# EAGLE design switch (EAGLE 7.6.0)
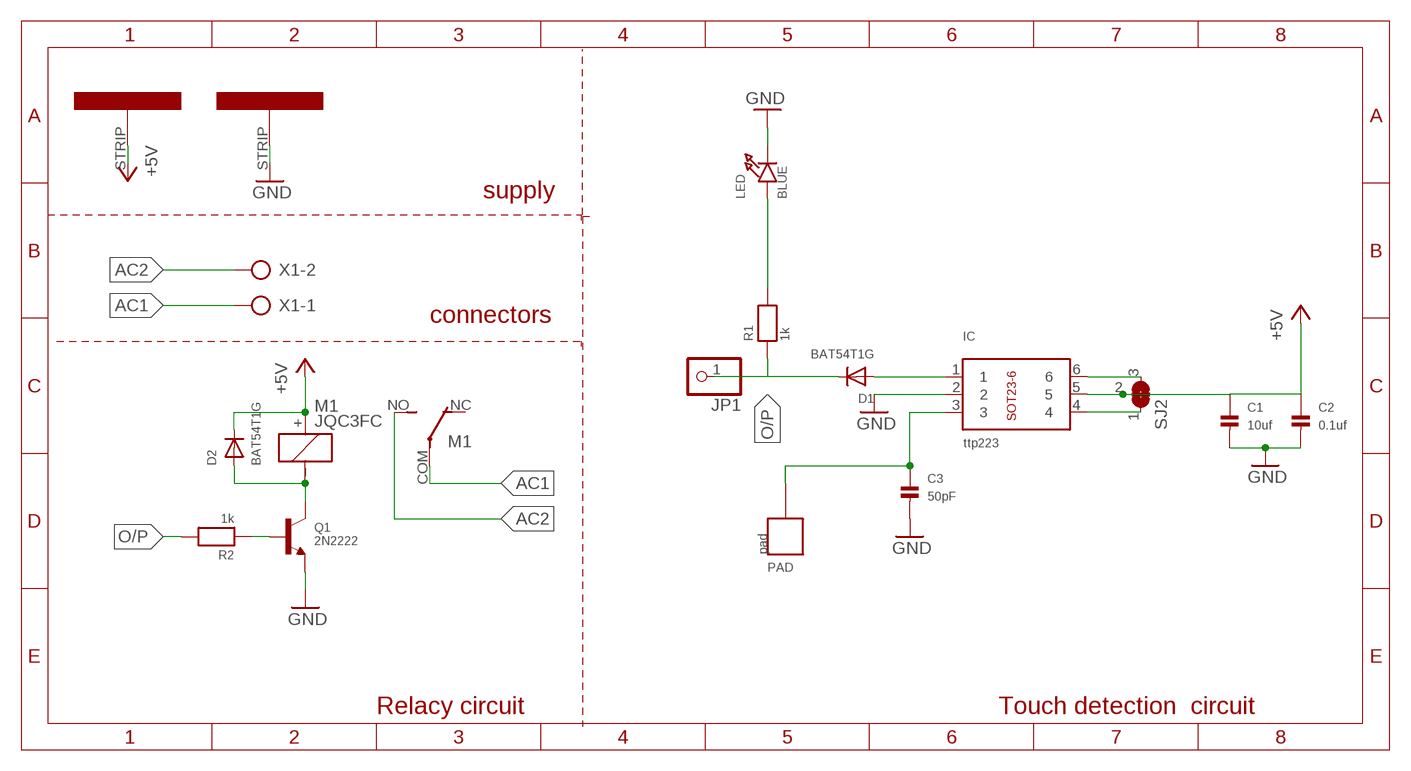
[diagram p0: schematic, sheet 1]

## Parts
C1  10uf  CAP_CERAMIC0805  [0805]
C2  0.1uf  CAP_CERAMIC0805  [0805]
C3  50pF  CAP_CERAMIC0805  [0805]
D1  BAT54T1G  DIODESOD-123  [SOD-123]
D2  BAT54T1G  DIODESOD-123  [SOD-123]
IC  ttp223  BREAKOUT_SOT23-6  [BREAKOUT_SOT23-6]
JP1  HEADER-1X12MM  [1X01_2MM]
LED  BLUE  LED0805  [CHIPLED_0805]
M1  JQC3FC  [JQC3FC]
PAD  pad  CAP_TOUCHPAD  [CAP_TOUCHPAD]
Q1  2N2222  TRANSISTOR_NPNWAVE  [SOT23-W]
R1  1k  RESISTOR0805  [0805]
R2  1k  RESISTOR0805  [0805]
RAIL1  RAIL1  STRIP  [STRIP]
RAIL2  RAIL2  STRIP  [STRIP]
SJ2  SOLDERJUMPER_2WAY0603  [SOLDERJUMPER_2WAY_OPEN_0603]
X1  AK500/2-H  [AK500/2-H]

## Nets
+5V: C1.1 C2.1 D2.C IC.5 M1.+ RAIL1.STRIP SJ2.2
AC1 [AC]: M1.COM X1.1
AC2 [AC]: M1.NO X1.2
GND: C1.2 C2.2 C3.2 IC.2 LED.C Q1.2(E) RAIL2.STRIP
N$1: LED.A R1.2
N$2: D1.A IC.1
N$3: C3.1 IC.3 PAD.P$1
N$4: D2.A M1._(-) Q1.3(C)
N$5: IC.6 SJ2.3
N$6: IC.4 SJ2.1
N$7: Q1.1(B) R2.1
O/P: D1.C JP1.1 R1.1 R2.2
Unconnected: M1.NC

## Notes on the sheet
- supply
- connectors
- Relacy circuit | Touch detection  circuit

## Library data of the parts
C1-C3 = microbuilder:CAP_CERAMIC: Ceramic Capacitors 0402 - 0402 Surface Mount Capacitors 16pF 50V 5% [Digikey: 445-4899-2-ND] 18pF 50V 5% [Digikey: 490-1281-2-ND] 22pF 50V 5% [Digikey: 490-1283-2-ND] 68pF 50V 5% [Digikey: 490-1289-2-ND] 0.1uF 10V 10% [Digikey: 490-1318-2-ND] 1.0uF 6.3V 10% [Digikey: 490-1320-2-ND] 0603 - 0603 Surface Mount Capacitors 16 pF 50V 5% [Digikey: 445-5051-2-ND] 22 pF 50V [Digikey: PCC220ACVTR-ND] 33 pF 50V 5% [Digikey: 490-1415-1-ND] 56pF 50V 5% [Digikey: 490-1421-1-ND] 220pF 50V 5% [Digikey: 445-1285-1-ND] 680 pF 50V 2200 pF 50V 5% C0G [Digikey: 445-1297-1-ND] 5600 pF 100V 5% X7R [Digikey: 478-3711-1-ND] 0.1 µF 25V 10% [Digikey: PCC2277TR-ND] 0.22 µF 16V 10% X7R [Digikey: 445-1318-1-ND] 1.0 µF 25V 10% [Digikey: 445-5146-2-ND] 0603 - RF Specific 3pF 250V +/-0.1pF RF [Digikey: 712-1347-1-ND] 18 pF 250V 5% [Digikey: 478-3505-1-ND or 712-1322-1-ND] 56 pF 250V 5% C0G RF [Digikey: 490-4867-1-ND] 68 pF 250V RF [Digikey: 490-4868-1-ND] 0805 - 0805 Surface Mount Capacitors 220 pF 250V 2% RF Ceramic Capacitor [Digikey: 712-1398-1-ND] 1000 pF 50V 2% NP0 Ceramic Capacitor [Digikey: 478-3760-1-ND] 0.1 µF 25V 10% Ceramic Capacitor [Digikey: PCC1828TR-ND] 1.0 µF 16V 10% Ceramic Capacitor[Digikey: 490-1691-2-ND] 10.0 µF 10V 10% Ceramic Capacitor[Digikey: 709-1228-1-ND] 10.0 uF 16V 10% Ceramic Capacitor [Digikey: 478-5165-2-ND] 47 uF 6.3V 20% Ceramic Capacitor [Digikey: 587-1779-1-ND or 399-5506-1-ND] 1206 - 1206 Surface Mount Capacitors 47uF 10V 20% Ceramic Capacitor [Digikey: 490-5528-1-ND or 399-5508-1-ND or 445-6010-1-ND] 100uF 6.3V -20%, +80% Y5V Ceramic Capacitor (Digikey: 490-4512-1-ND, Mouser: 81-GRM31CF50J107ZE1L)
D1 D2 = microbuilder:DIODE: Diode SMA Model Volts Amps Type Vf Vr Digikey # Notes SSA34-E3 40V 3A Schottky 480mV @ 3A 200uA @ 40V SSA34-E3/61TGITR-ND CDBA120-G 20V 1A Schottky 500mV @ 1A 500uA @ 20V 641-1014-6-ND REEL MBRA210 10V 2A Schottky 350mV @ 2A 700uA @ 10V MBRA210LT3 SOD-123 Model Volts Amps Type Vf Vr Order # Notes BAT54T1G 30V 200mA Schottky 800mV @ 200mA 2uA @ 25V BAT54T1GOSTR-ND B0530W 30V 500mA Schottky 430mV @ 500mA 130uA @ 30V B0530W-FDICT-ND REEL MBR120 1A 20V Schottky 340mV @ 1A MBR120VLSFT1GOSCT-ND SOD-323 Model Volts Amps Type Vf Vr Order # Notes PMEG2005EJ 20V 500mA Schottky 355mV @ 500mA 568-4110-1-ND ZLLS410 10V 570mA Schottky 380mV @ 570mA ZLLS410CT-ND 1N4148WS 75V 150mA Silicon/Simple 1V 1N4148WSFSCT-ND REEL SOD-523 Model Volts Amps Type Vf Vr Order # Notes BAT54XV2 30V 200mA Schottky 0.8V @ 100mA BAT54XV2CT-ND TB751S 30V 30mA Schottky RB751S-40TE61CT-ND SOT23-R/W (R = Solder Paste/Reflow Ovens, W = Hand-Soldering) Model Volts Amps Type Vf Vr Order # Notes BAT54FILM 40V 300mA Schottky 497-7162-1-ND
IC = microbuilder:BREAKOUT_SOT23-6: IC Breakout SOT23-6
JP1 = microbuilder:HEADER-1X1: PIN HEADER
LED = microbuilder:LED: LED 0603 - 0603 Surface Mount Package 2mA: Green LED - Low Power (3.9mcd, 2ma, 1.7Vf) - Digikey: 475-2709-2-ND Orange LED - Low Power (9.8mcd, 2ma, 1.8Vf) - Digikey: 475-1194-2-ND Red LED - Low Power (5mcd, 2ma, 1.8Vf) - Digikey: 475-1195-2-ND Yellow LED - Low Power (7mcd, 2ma, 1.8Vf) - Digikey: 475-1196-2-ND 5mA: Blue LED - Low Power (17mcd, 5ma, 2.9Vf) - Digikey: LNJ937W8CRACT-ND 0805 - 0805 Surface Mount Package 2mA: Red LED (8.8mcd, 2mA, 1.8Vf, Clear) - Low Power [Digikey: 475-2510-1-ND] Green LED (5mcd, 2mA, 1.8Vf, Clear) - Low Power [Digikey: 475-2730-1-ND] Yellow LED (11.3mcd, 2mA, 1.8Vf, Clear) - Low Power [Digikey: 475-2555-1-ND] 20mA: Red LED (104mcd, 20mA, Diffused) - LS R976 [Digikey: 475-1278-6-ND] Red LED (12mcd, 20mA, 2.0Vf, Clear) - APT2012EC [Digikey: 754-1128-1-ND] Green LED (15mcd, 20mA, 2.2Vf, Clear) - APT2012GC [Digikey: 754-1131-1-ND] Orange LED (160mcd, 20mA, 2.1Vf, Clear) - APT2012SECK [Digikey: 754-1130-1-ND] 1206 - 1206 Surface Mount Package Green LED (26mcd, 20mA, Diffused) - LG N971 [Digikey: 475-1407-6-ND] Red LED (15mcd, 20mA, Diffused) - LH N974 [Digikey: 475-1416-6-ND]
M1 = Alfred:JQC3FC
PAD = Alfred:CAP_TOUCHPAD
Q1 = microbuilder:TRANSISTOR_NPN: NPN Transistor Transistor (NPN) 500mA 45V - BC817 [Digikey: 568-1631-1-ND] Transistor (NPN) 500mA 45V - BC817,215 [Mouser: 771-BC817-T/R] SOT23-R - SOT23 footprint optimised for use with solder paste and reflow ovens. SOT23-W - SOT23 footprint optimised for hand-soldering (larger pads).
R1 R2 = microbuilder:RESISTOR: Resistors 0402 - 0402 Surface Mount Package 22 Ohm 1% 1/16W [Digikey: 311-22.0LRTR-ND] 33 Ohm 5% 1/16W 1.0K 5% 1/16W 1.5K 5% 1/16W 2.0K 1% 1/16W 10.0K 1% 1/16W [Digikey: 311-10.0KLRTR-ND] 10.0K 5% 1/16W [Digikey: RMCF0402JT10K0TR-ND] 12.1K 1% 1/16W [Digikey: 311-22.0LRTR-ND] 100.0K 5% 1/16W 0603 - 0603 Surface Mount Package 0 Ohm 1/10 Watt 1% Resistor 15 Ohm 1/10 Watt 1% Resistor 33 Ohm 1/10 Watt 1% Resistor 49.9 Ohm 1/10 Watt 1% Resistor 100 Ohm 1/10 Watt 1% Resistor 150 Ohm 1/10 Watt 1% Resistor 240 Ohm 1/10 Watt 1% Resistor 390 Ohm 1/10 Watt 1% Resistor 560 Ohm 1/10 Watt 1% Resistor 680 Ohm 1/10 Watt 1% Resistor 750 Ohm 1/10 Watt 1% Resistor 1.0K Ohm 1/10 Watt 1% Resistor 1.5K Ohm 1/10 Watt 1% Resistor 2.0K Ohm 1/10 Watt 1% Resistor 2.2K Ohm 1/10 Watt 1% Resistor 3.3K Ohm 1/10 Watt 1% Resistor 4.7K Ohm 1/10 Watt 1% Resistor 10.0K Ohm 1/10 Watt 1% Resistor 12.0K Ohm 1/10 Watt 1% Resistor 12.1K Ohm 1/10 Watt 1% Resistor 20.0K Ohm 1/10 Watt 1% Resistor 33.0K Ohm 1/10 Watt 1% Resistor 100.0K Ohm 1/10 Watt 1% Resistor 0805 - 0805 Surface Mount Package 0 Ohm 1/8 Watt 1% Resistor 33 Ohm 1/8 Watt 1% Resistor 100 Ohm 1/8 Watt 1% Resistor 150 Ohm 1/8 Watt 1% Resistor 200 Ohm 1/8 Watt 1% Resistor 240 Ohm 1/8 Watt 1% Resistor 330 Ohm 1/8 Watt 1% Resistor 390 Ohm 1/8 Watt 1% Resistor 470 Ohm 1/8 Watt 1% Resistor 1.0K Ohm 1/8 Watt 1% Resistor 1.5K Ohm 1/8 Watt 1% Resistor 2.0K Ohm 1/8 Watt 1% Resistor 4.7K Ohm 1/8 Watt 1% Resistor 5.1K Ohm 1/8 Watt 1% Resistor 5.6K Ohm 1/8 Watt 1% Resistor 10.0K Ohm 1/8 Watt 1% Resistor 22.0K Ohm 1/8 Watt 1% Resistor 33.0K Ohm 1/8 Watt 1% Resistor 100K Ohm 1/8 Watt 1% Resistor 1206 - 1206 Surface Mount Package 2012 - 2010 Surface Mount Package 0.11 Ohm 1/2 Watt 1% Resistor - Digikey: RHM.11UCT-ND
RAIL1 RAIL2 = Alfred:STRIP
SJ2 = microbuilder:SOLDERJUMPER_2WAY: 2-Way Solder Jumper
X1 = con-ptr500:AK500/2-H: CONNECTOR Aug. 2004 / PTR Meßtechnik: Die Bezeichnung der Serie AK505 wurde geändert. Es handelt sich hierbei um AK500 in horizontaler Ausführung.; OC_FARNELL: unknown; OC_NEWARK: unknown

## Net classes
0 default: width 0.4 mm, clearance 0.381 mm
1 AC: width 1.5 mm, clearance 0.381 mm to class 0, clearance 0.381 mm

## Board
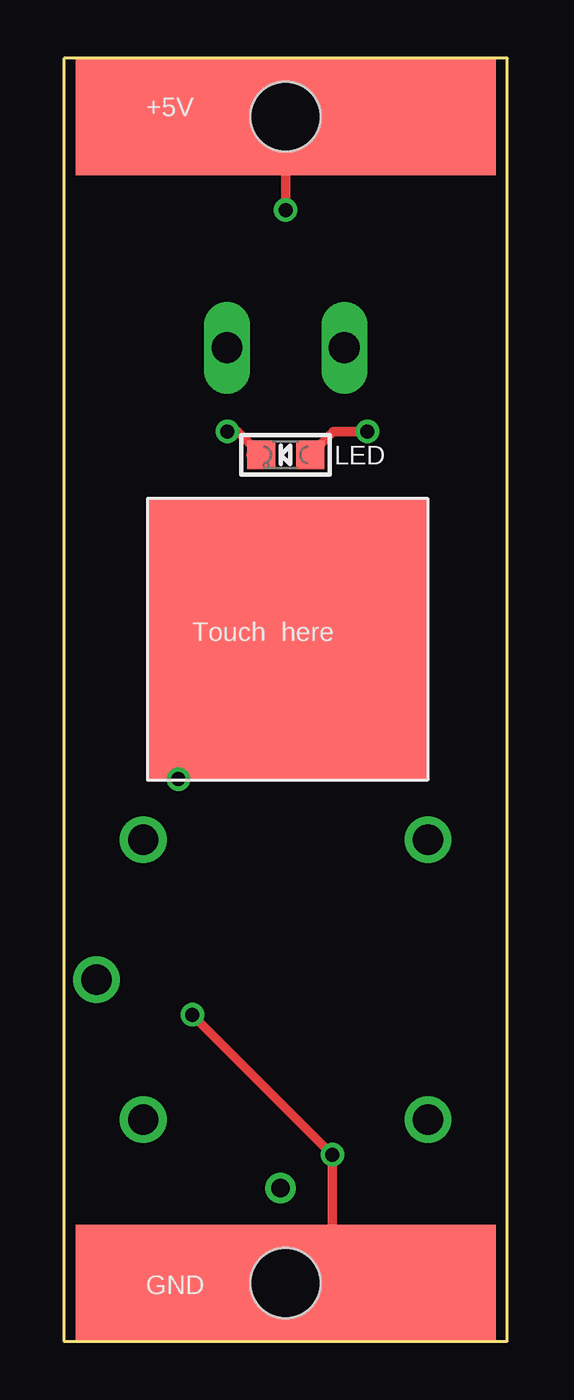
[diagram p1: board, top side]
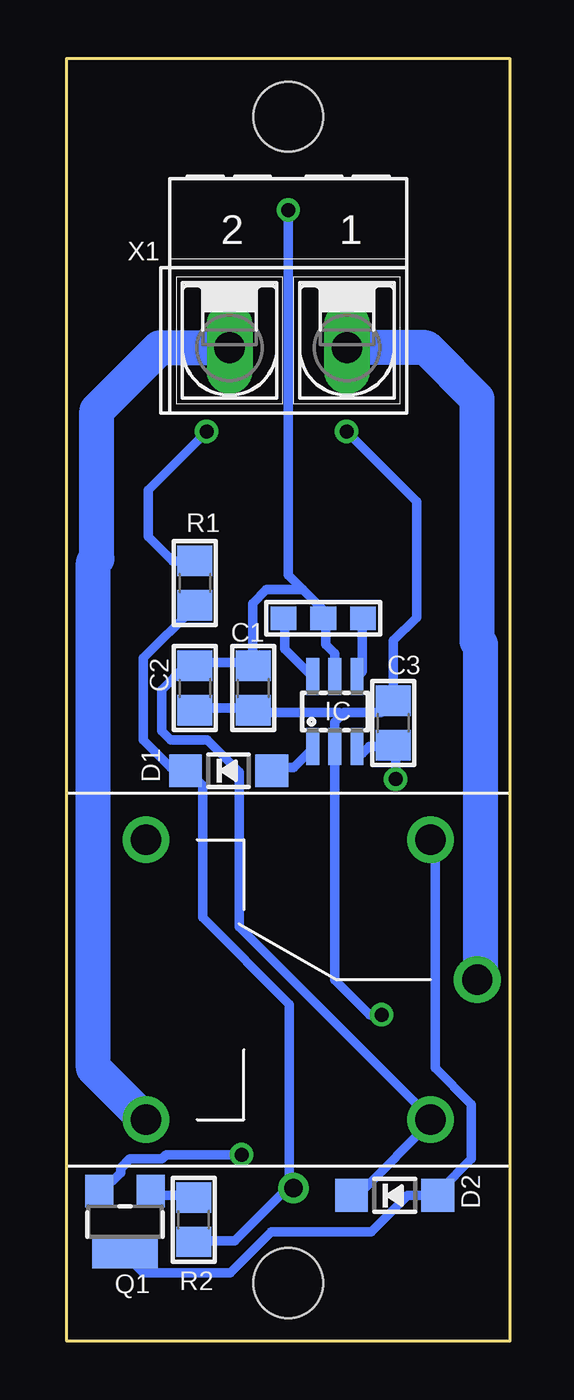
[diagram p2: board, bottom side, seen from below]

Size 19 x 55 mm. Coordinates in mm from the lower left corner, seen from the top.
Outline: 0,0 19,0 19,55 0,55 0,0
Copper layers (1*16): Top 0.035mm / dielectric 0.5mm / Bottom 0.035mm
Design rules "default *": minimum track width 5mil, minimum drill 10mil, track to track 5mil, track to pad 8mil, pad to pad 8mil, via to via 8mil, smd to smd 8mil, copper to edge 0.3mm, drill to drill 8mil, minimum pad ring 10mil, minimum via ring 8mil, stop-mask expansion 4mil, vias tented up to drill 0.6mm, thermal gap 10mil

### Footprints (pad centres in the part's own frame; a part is rotated, then mirrored left to right if it is on the bottom)
0805 = smd 1.3 x 1.5: 1 -0.95,0; 2 0.95,0
SOD-123 = smd 1.4 x 1.4: A 1.85,0; C -1.85,0
BREAKOUT_SOT23-6 = smd 0.55 x 1.6: 1 -0.95,-1.5; 2 0,-1.5; 3 0.95,-1.5; 4 0.95,1.5; 5 0,1.5; 6 -0.95,1.5
1X01_2MM = drill 0.8 pad 1.27: 1 0,0
CHIPLED_0805 = smd 1.2 x 1.2: A 0,-1.05; C 0,1.05
JQC3FC = drill 1.3 pad 2: + -6.2,6; _ -6.2,-6; COM -8.2,0; NC 6,-6; NO 6,6
CAP_TOUCHPAD = smd 12 x 12: P$1 0,0
SOT23-W = smd 1.2 x 1.4: 1 -1.1,-1.3; 2 1.1,-1.3 | smd 2.8 x 1.4: 3 0,1.3
STRIP = smd 18 x 5: STRIP 0,0 | hole 3: 0,0
SOLDERJUMPER_2WAY_OPEN_0603 = smd 1.1 x 1: 1 -1.7,0; 2 0,0; 3 1.7,0
AK500/2-H = drill 1.321 long: 1 -2.515,0; 2 2.515,0

### Placement (x,y rotation side)
C1  11,28 270 bottom
C2  13.5,28 270 bottom
C3  5,26.5 90 bottom
D1  12.06,24.46 0 bottom
D2  4.94,6.25 0 bottom
IC  7.5,27 0 bottom
JP1  9.28,6.56 0 bottom
LED  9.5,38 90 top
M1  9.6,15.5 180 bottom
PAD  9.6,30.1 0 top
Q1  16.5,5.13 180 bottom
R1  13.5,32.5 90 bottom
R2  13.56,5.21 270 bottom
RAIL1  9.5,52.5 0 top
RAIL2  9.5,2.5 0 top
SJ2  8,31 180 bottom
X1  9.5,42.59 180 bottom

### Tracks (layer width: path | path; a pad name or v marks a point on that pad's centre or on a via)
+5V  (via drill 0.6)
  Top 0.406: v9.5,48.5 RAIL1.STRIP
  Bottom 0.4: IC.5 7.5,29.48 7.9,29.87 7.9,30.85 SJ2.2 8.09,31.05 8.09,31.43 8.87,32.22 10.43,32.22 11.02,31.63 11.02,29.29 C1.1 11.02,29.09 13.36,29.09 C2.1 13.56,28.9 13.95,28.9 14.93,27.92 14.93,26.16 14.53,25.77 12.97,25.77 11.61,24.41 11.61,17.77 3.4,9.57 M1.+ 3.4,9.37 6.33,6.44 6.72,6.44 D2.C
  Bottom 0.406: 8.87,32.22 9.5,32.84 v9.5,48.5
AC1
  Bottom 1.5: 6.92,42.56 X1.1 3.59,42.59 1.4,40.4 1.4,30.02 1.26,29.87 1.26,15.62 M1.COM
AC2
  Bottom 1.5: 12.19,42.56 X1.2 15.01,42.59 17.7,39.9 17.7,33.54 17.85,33.39 17.85,11.71 15.71,9.57 M1.NO
GND  (via drill 0.6)
  Top 0.406: RAIL2.STRIP 10,2.5 11.5,4 v11.5,8 v5.5,14 | 8,38 LED.C 7.45,39 v7,39
  Bottom 0.4: C2.2 13.36,27.14 11.02,27.14 C1.2 10.82,26.95 7.31,26.95 7.21,26.85 | 14.93,7.81 16.29,7.81 16.68,7.42 16.68,7.22 17.46,6.44 Q1.2 | 7.12,26.95 7.21,26.85 | 7.21,26.85 7.5,26.55 7.5,25.58 IC.2
  Bottom 0.406: 14.93,7.81 14.73,8 v11.5,8 | IC.2 7.5,15.5 6,14 v5.5,14 | 7.12,26.95 5.5,26.95 C3.2 5,30.04 4,31.04 4,36 v7,39
N$1  (via drill 0.6)
  Top 0.406: v13,39 11.55,39 LED.A
  Bottom 0.406: R1.2 14.45,33.45 15.5,34.5 15.5,36.5 v13,39
N$2
  Bottom 0.4: D1.A 10.04,24.6 9.26,24.6 8.48,25.38 IC.1
N$3  (via drill 0.6)
  Top 0.406: PAD.P$1 4.9,24.9 v4.9,24.1
  Bottom 0.4: 6.33,25.19 6.53,25.38 IC.3
  Bottom 0.406: 6.33,25.19 6.02,25.5 5.05,25.5 C3.1 4.9,25.45 v4.9,24.1
N$4
  Bottom 0.4: Q1.3 16.49,3.71 15.71,2.93 12,2.93 10.24,4.69 5.94,4.69 4.38,6.25 3.21,6.25 D2.A 3.01,6.44 1.65,7.81 1.65,10.15 3.21,11.71 3.21,21.48 M1._
N$5
  Bottom 0.4: SJ2.3 9.65,30.85 9.65,29.68 8.48,28.51 IC.6
N$6
  Bottom 0.4: SJ2.1 6.33,30.85 6.33,28.7 6.53,28.51 IC.4
N$7
  Bottom 0.4: Q1.1 15.31,6.25 13.75,6.25 R2.1
O/P
  Bottom 0.4: R2.2 13.56,4.29 11.8,4.29 9.46,6.64 JP1.1 9.46,6.83 9.46,14.45 13.17,18.16 13.17,23.82 13.75,24.41 D1.C 13.95,24.6 14.53,24.6 15.71,25.77 15.71,29.29 13.56,31.43 R1.1

### Text on the board
tNames: +5V | Touch here | GND